# Altium schematic sheet 111.SchDoc
size A4
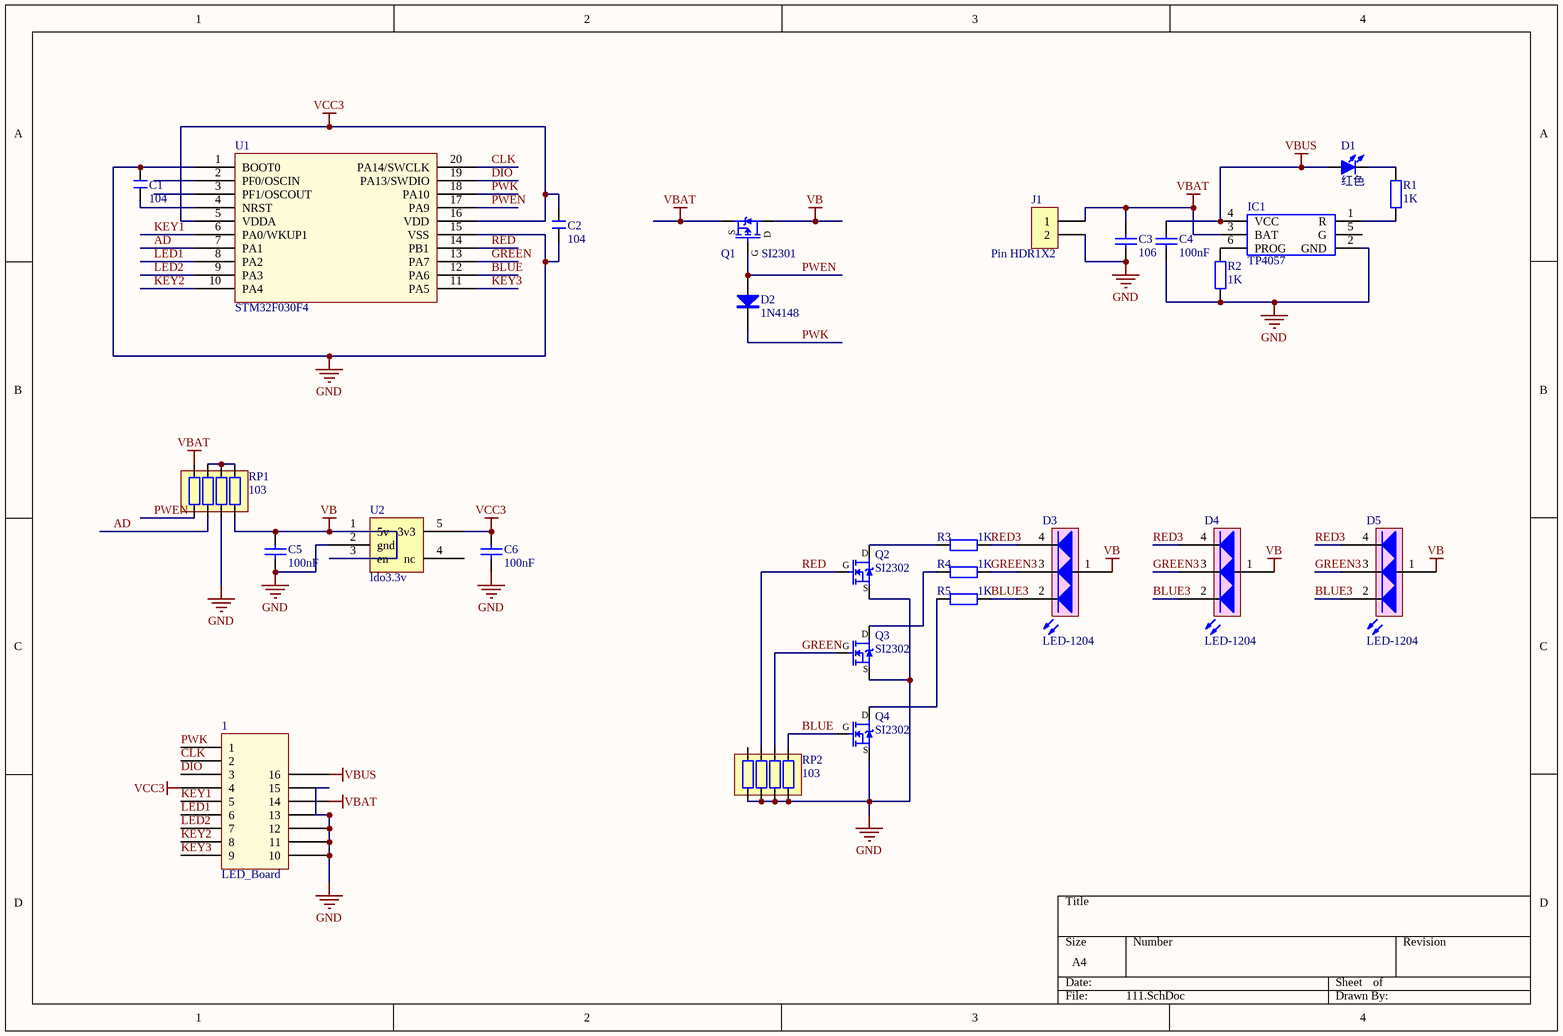
[diagram p0: 111.SchDoc]

## Parts
1  LED_Board  [LED_KO]
C1  104  [C 0402_M]
C2  104  [C 0402_M]
C3  value 106  [C-RAD-0805]  (hidden comment: Cap)
C4  value 100nF  [C-RAD-0603]  (hidden comment: Cap)
C5  value 100nF  [C-RAD-0603]  (hidden comment: Cap)
C6  value 100nF  [C-RAD-0603]  (hidden comment: Cap)
D1  红色  [LED 0603R]
D2  1N4148  [SOD-323]
D3  LED-1204  [LED_1204]
D4  LED-1204  [LED_1204]
D5  LED-1204  [LED_1204]
IC1  TP4057  [SOT23-6M]
J1  Pin HDR1X2  [Pin HDR1X2/2.54mm-S]
Q1  SI2301  [SOT23-3N]
Q2  SI2302  [SOT23-3N]
Q3  SI2302  [SOT23-3N]
Q4  SI2302  [SOT23-3N]
R1  1K  [R 0402_M]
R2  1K  [R 0402_M]
R3  value 1K  [0603-1]  (hidden comment: Res1)
R4  value 1K  [0603-1]  (hidden comment: Res1)
R5  value 1K  [0603-1]  (hidden comment: Res1)
RP1  103  [RCA-8P4R-0402]
RP2  103  [RCA-8P4R-0402]
U1  STM32F030F4  [TSSOP20]
U2  ldo3.3v  [SOT23-5]

## Nets
GND: 1.10 1.11 1.12 1.13 1.15 C1.2 C2.1 C3.1 C4.1 C5.1 C6.1 IC1.2(GND) J1.2 Q2.2(S) Q3.2(S) Q4.2(S) R2.1 RP1.3 RP2.1 RP2.2 RP2.3 RP2.4 U1.1(BOOT0) U1.15(VSS) U2.2(gnd)
VB: C5.2 D3.1 D4.1 D5.1 Q1.3(D) RP1.4 U2.1(5v) U2.3(en)
VBAT: 1.14 C3.2 IC1.3(BAT) J1.1 Q1.2(S) RP1.8
VBUS: 1.16 C4.2 D1.1(A) IC1.4(VCC)
VCC3: 1.4 C2.2 C6.2 U1.5(VDDA) U1.16(VDD) U2.5(3v3)
AD: RP1.2 U1.7(PA1)
BLUE: Q4.1(G) RP2.5 U1.12(PA6)
BLUE3: D3.2(B) D4.2(B) D5.2(B) R5.2
CLK: 1.2 U1.20(PA14/SWCLK)
DIO: 1.3 U1.19(PA13/SWDIO)
GREEN: Q3.1(G) RP2.6 U1.13(PA7)
GREEN3: D3.3(G) D4.3(G) D5.3(G) R4.2
KEY1: 1.5 U1.6(PA0/WKUP1)
KEY2: 1.8 U1.10(PA4)
KEY3: 1.9 U1.11(PA5)
LED1: 1.6 U1.8(PA2)
LED2: 1.7 U1.9(PA3)
PWEN: D2.A Q1.1(G) RP1.1 U1.17(PA9)
PWK: 1.1 D2.K U1.18(PA10)
RED: Q2.1(G) RP2.7 U1.14(PB1)
RED3: D3.4(R) D4.4(R) D5.4(R) R3.2
NetC1_1: C1.1 U1.4(NRST)
NetD1_2: D1.2(K) R1.2
NetIC1_1: IC1.1(R) R1.1
NetIC1_6: IC1.6(PROG) R2.2
NetQ2_3: Q2.3(D) R3.1
NetQ3_3: Q3.3(D) R4.1
NetQ4_3: Q4.3(D) R5.1
NetRP1_5: RP1.5 RP1.6 RP1.7

Not connected (* = marked no-connect by the designer): IC1 5(G); RP2 8; U1 2(PF0/OSCIN) 3(PF1/OSCOUT); U2 4(nc)

## Library data of the parts
C1 C2 = C: 无极性贴片电容; 版权归属: 源创客; 材质: X7R; BOM名称: 无极性贴片电容; 学习资源: www.ooocke.com
C3-C6 = Cap: 无极性电容; Published: 8-Jun-2000; LatestRevisionDate: 17-Jul-2002; LatestRevisionNote: Re-released for DXP Platform.; PackageReference: RAD-0.3; Publisher: Altium Limited
D1 = LED-SMD: 贴片LED; 版权归属: 源创客; BOM名称: 贴片LED; 学习资源: www.ooocke.com
D2 = 1N4148: 高速开关二极管; 版权归属: 源创客; BOM名称: 高速开关二极管; 学习资源: www.ooocke.com
D3-D5 = LED-1204: 三基色LED; Published: 8-Jun-2000; LatestRevisionDate: 08-Jul-2005; LatestRevisionNote: Mech Layer 1 removed.; PackageReference: LED-0; Publisher: Altium Limited
Q1 = SI2301: P沟道 20V/2.8A; BOM名称: 场效应管; 版权归属: 源创客; 学习资源: www.ooocke.com; 描述: P沟道 20V/2.8A
Q2-Q4 = SI2302: N沟道 20V/3A; BOM名称: 场效应管; 版权归属: 源创客; 学习资源: www.ooocke.com; 描述: N沟道 20V/3A
R1 R2 = R: 贴片电阻; 版权归属: 源创客; BOM名称: 贴片电阻; 学习资源: www.ooocke.com
R3-R5 = Res1: 贴片电阻; Published: 8-Jun-2000; LatestRevisionDate: 17-Jul-2002; LatestRevisionNote: Re-released for DXP Platform.; PackageReference: AXIAL-0.4; Publisher: Altium Limited
RP1 RP2 = R-8P4R: 贴片网络排阻; 版权归属: 源创客; BOM名称: 贴片网络排阻; 学习资源: www.ooocke.com
U2 = Component_1